# Altium schematic sheet Peripherals.SchDoc
size A4; Revision: B.2(PCB.SCH)
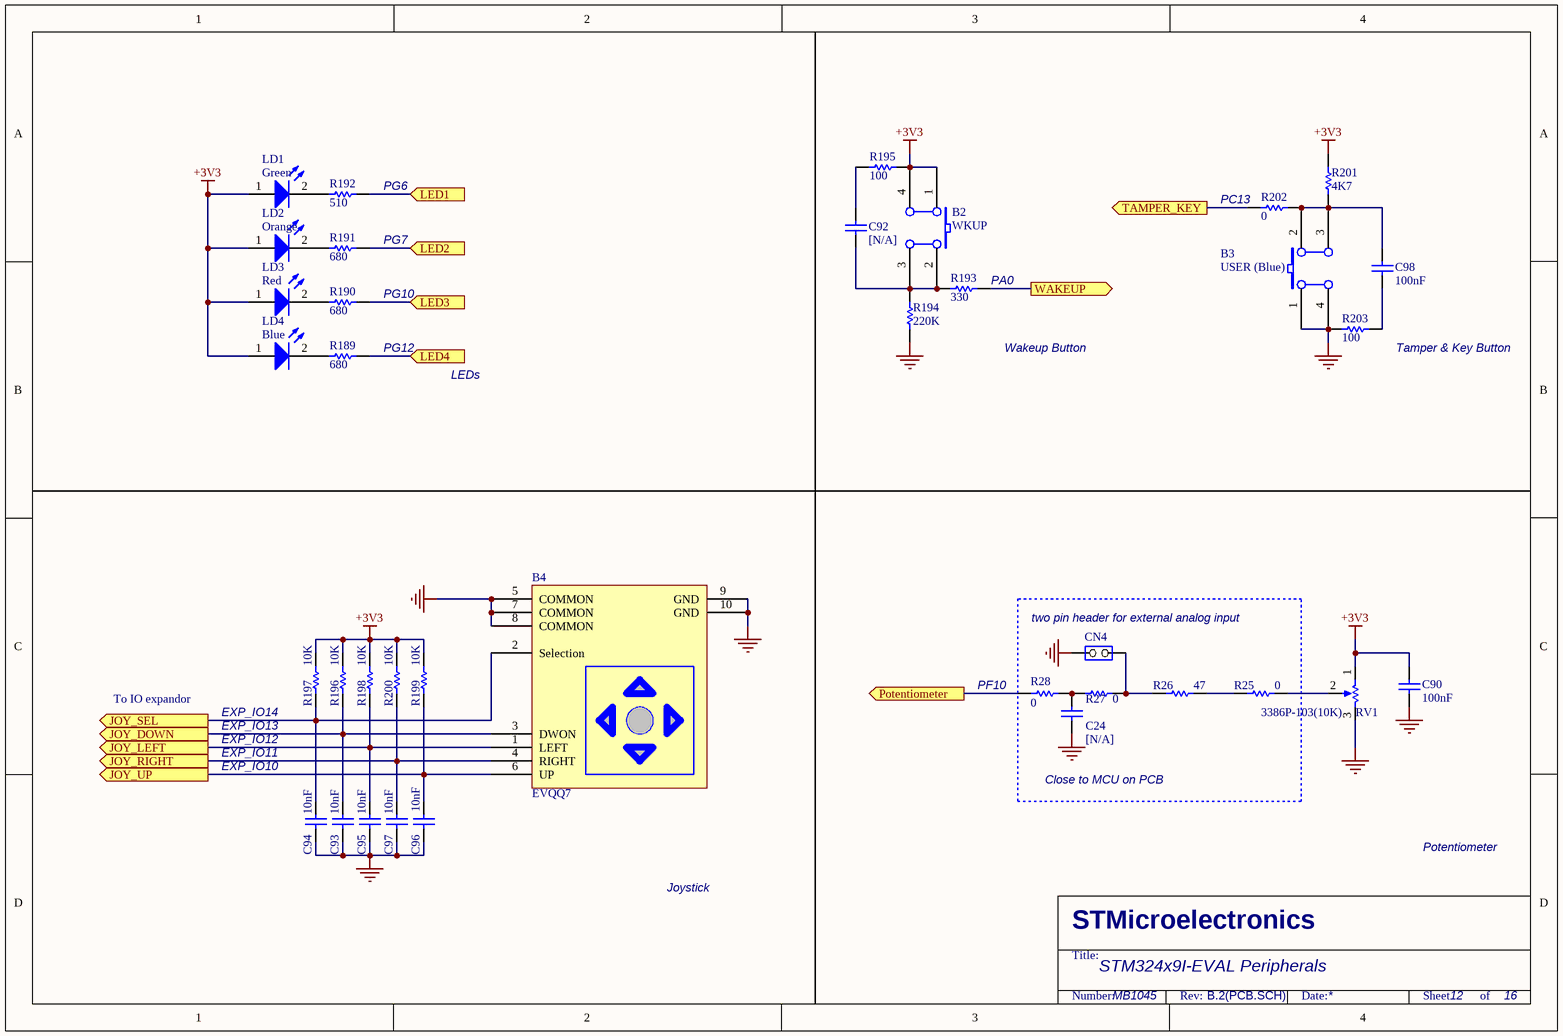
[diagram p0: Peripherals.SchDoc]

## Parts
B2  WKUP  [PB10]
B3  USER (Blue)  [PB10]
B4  EVQQ7  [SW-JOY]
C24  [N/A]  [0603C]
C90  100nF  [0603C]
C92  [N/A]  [0603C]
C93  10nF  [0603C]
C94  10nF  [0603C]
C95  10nF  [0603C]
C96  10nF  [0603C]
C97  10nF  [0603C]
C98  100nF  [0603C]
CN4  (no value)  [SIP2]
LD1  Green  [0603D]
LD2  Orange  [0603D]
LD3  Red  [0603D]
LD4  Blue  [0603D]
R25  0  [0603R]
R26  47  [0603R]
R27  0  [0603R]
R28  0  [0603R]
R189  680  [0603R]
R190  680  [0603R]
R191  680  [0603R]
R192  510  [0603R]
R193  330  [0603R]
R194  220K  [0603R]
R195  100  [0603R]
R196  10K  [0603R]
R197  10K  [0603R]
R198  10K  [0603R]
R199  10K  [0603R]
R200  10K  [0603R]
R201  4K7  [0603R]
R202  0  [0603R]
R203  100  [0603R]
RV1  3386P-103(10K)  [3386P]

## Ports
JOY_DOWN (out), JOY_LEFT (out), JOY_RIGHT (out), JOY_SEL (out), JOY_UP (out), LED1 (in), LED2 (in), LED3 (in), LED4 (in), Potentiometer (out), TAMPER_KEY (out), WAKEUP (out)

## Nets
+3V3: B2.1(A0) B2.4(A1) C90.1 LD1.1(A) LD2.1(A) LD3.1(A) LD4.1(A) R195.1 R196.1 R197.1 R198.1 R199.1 R200.1 R201.2 RV1.1(BOT)
GND: B3.1(A0) B3.4(A1) B4.5(COMMON) B4.7(COMMON) B4.8(COMMON) B4.9(GND) B4.10(GND) C24.1 C90.2 C93.1 C94.1 C95.1 C96.1 C97.1 CN4.2(NO) R194.2 R203.1 RV1.3(TOP)
JOY_DOWN: B4.3(DWON) C93.2 R196.2 ; port JOY_DOWN
JOY_LEFT: B4.1(LEFT) C95.2 R198.2 ; port JOY_LEFT
JOY_RIGHT: B4.4(RIGHT) C97.2 R200.2 ; port JOY_RIGHT
JOY_SEL: B4.2(Selection) C94.2 R197.2 ; port JOY_SEL
JOY_UP: B4.6(UP) C96.2 R199.2 ; port JOY_UP
LED1: R192.1 ; port LED1
LED2: R191.1 ; port LED2
LED3: R190.1 ; port LED3
LED4: R189.1 ; port LED4
Potentiometer: R28.2 ; port Potentiometer
TAMPER_KEY: R202.2 ; port TAMPER_KEY
WAKEUP: R193.2 ; port WAKEUP
NetB2_2: B2.2(B0) B2.3(B1) C92.2 R193.1 R194.1
NetB3_2: B3.2(B0) B3.3(B1) C98.2 R201.1 R202.1
NetC24_2: C24.2 R27.1 R28.1
NetC92_1: C92.1 R195.2
NetC98_1: C98.1 R203.2
NetCN4_1: CN4.1(COMMON) R26.1 R27.2
NetLD1_2: LD1.2(K) R192.2
NetLD2_2: LD2.2(K) R191.2
NetLD3_2: LD3.2(K) R190.2
NetLD4_2: LD4.2(K) R189.2
NetR25_1: R25.1 R26.2
NetR25_2: R25.2 RV1.2(TAP)

## Notes on the sheet
- (near R192) PG6
- (near R191) PG7
- (near R202) PC13
- (near R190) PG10
- (near R193) PA0
- (near R189) PG12
- LEDs
- Wakeup Button
- (near R203) Tamper & Key Button
- (near CN4) two pin header for external analog input
- To IO expandor
- EXP_IO14
- (near R28) PF10
- EXP_IO10
- EXP_IO11
- EXP_IO12
- EXP_IO13
- Close to MCU on PCB
- Potentiometer
- Joystick
- STM324x9I-EVAL Peripherals
- MB1045
- 12
- 16
- STMicroelectronics
- Title:
- Number:
- Rev:
- Date:
- Sheet          of

## Library data of the parts
B2 B3 = SW PUSHBUTTON: SE PUSHBUTTON
C24 = cap: Capacitor; Value: 100pF; Published: 8-Jun-2000; Revision: July-2002: Re-released for DXP Platform.; Publisher: Altium Limited
C90 C92-C98 = CAP: Capacitor; Value: 100pF; Published: 8-Jun-2000; Revision: July-2002: Re-released for DXP Platform.; Publisher: Altium Limited
CN4 = JP2
LD1-LD4 = LED2: Typical RED, GREEN, YELLOW, AMBER GaAs LED; Published: 8-Jun-2000; Revision: July-2002: Re-released for DXP Platform.; Publisher: Altium Limited
R25-R28 R189-R193 R195 R202 R203 = Res1: Resistor; Value: 1K; Published: 8-Jun-2000; Revision: July-2002: Re-released for DXP Platform.; Publisher: Altium Limited
R194 R196-R201 = res1: Resistor; Value: 1K; Published: 8-Jun-2000; Revision: July-2002: Re-released for DXP Platform.; Publisher: Altium Limited
RV1 = RV